# Altium schematic sheet gpios.SchDoc
size A4
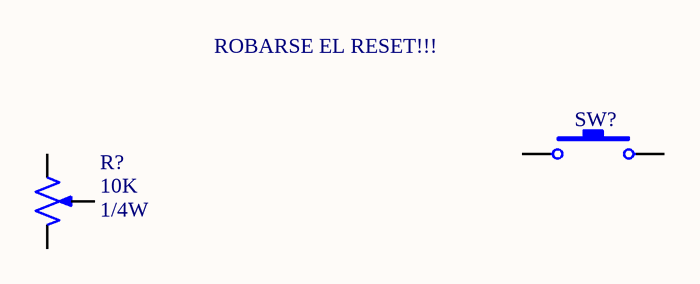
[diagram p0: gpios.SchDoc]

## Parts
R?  valor: 10K  Potencia: 1/4W  [POTE]  (hidden comment: Potenciometro)
SW?  TAC_SWITCH_4  [TAC_SW_4]  (value not drawn)

## Nets

Not connected (* = marked no-connect by the designer): R? Left Right X(Punto_medio); SW? 1 2

## Notes on the sheet
- ROBARSE EL RESET!!!

## Library data of the parts
R? = Potenciometer: Cod. Proveedor: 480-5885-ND; Proveedor: Digi-Key; Encapsulado: Montaje en panel; Link: https://www.digikey.com/product-detail/es/53C310K/480-5885-ND/3532491?utm_campaign=buynow&WT.z_cid=ref_octopart_dkc_buynow&utm_medium=aggregator&curr=usd&site=us&utm_source=octopart
SW? = TAC_SWITCH_4: Pulsador de 4 pines; Proveedor: Digi-Key; Cod. Proveedor: GH1365-ND; Encapsulado: Montaje en panel, posterior; Fabricante: Grayhill Inc.; Link: https://www.digikey.com/product-detail/es/30-3/GH1365-ND/686796?utm_campaign=buynow&WT.z_cid=ref_octopart_dkc_buynow&utm_medium=aggregator&curr=usd&site=us&utm_source=octopart